# EAGLE schematic temperature_sensor (EAGLE 9.6.2)
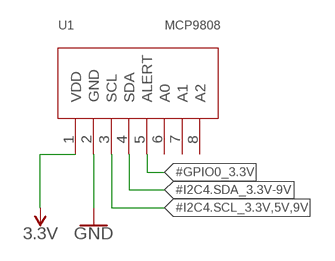
[diagram p0: schematic, sheet 1]

## Parts
U1  MCP9808  [MCP9808]

## Nets
3.3V: U1.1(VDD)
#GPIO0_3.3V: U1.5(ALERT)
#I2C4.SCL_3.3V,5V,9V: U1.3(SCL)
#I2C4.SDA_3.3V-9V: U1.4(SDA)
GND: U1.2(GND)
Unconnected: U1.6(A0) U1.7(A1) U1.8(A2)

## Library data of the parts
U1 = MCP9808:MCP9808